# Altium schematic sheet Sheet1.SchDoc
size A; SheetNumber: 1; SheetTotal: 1
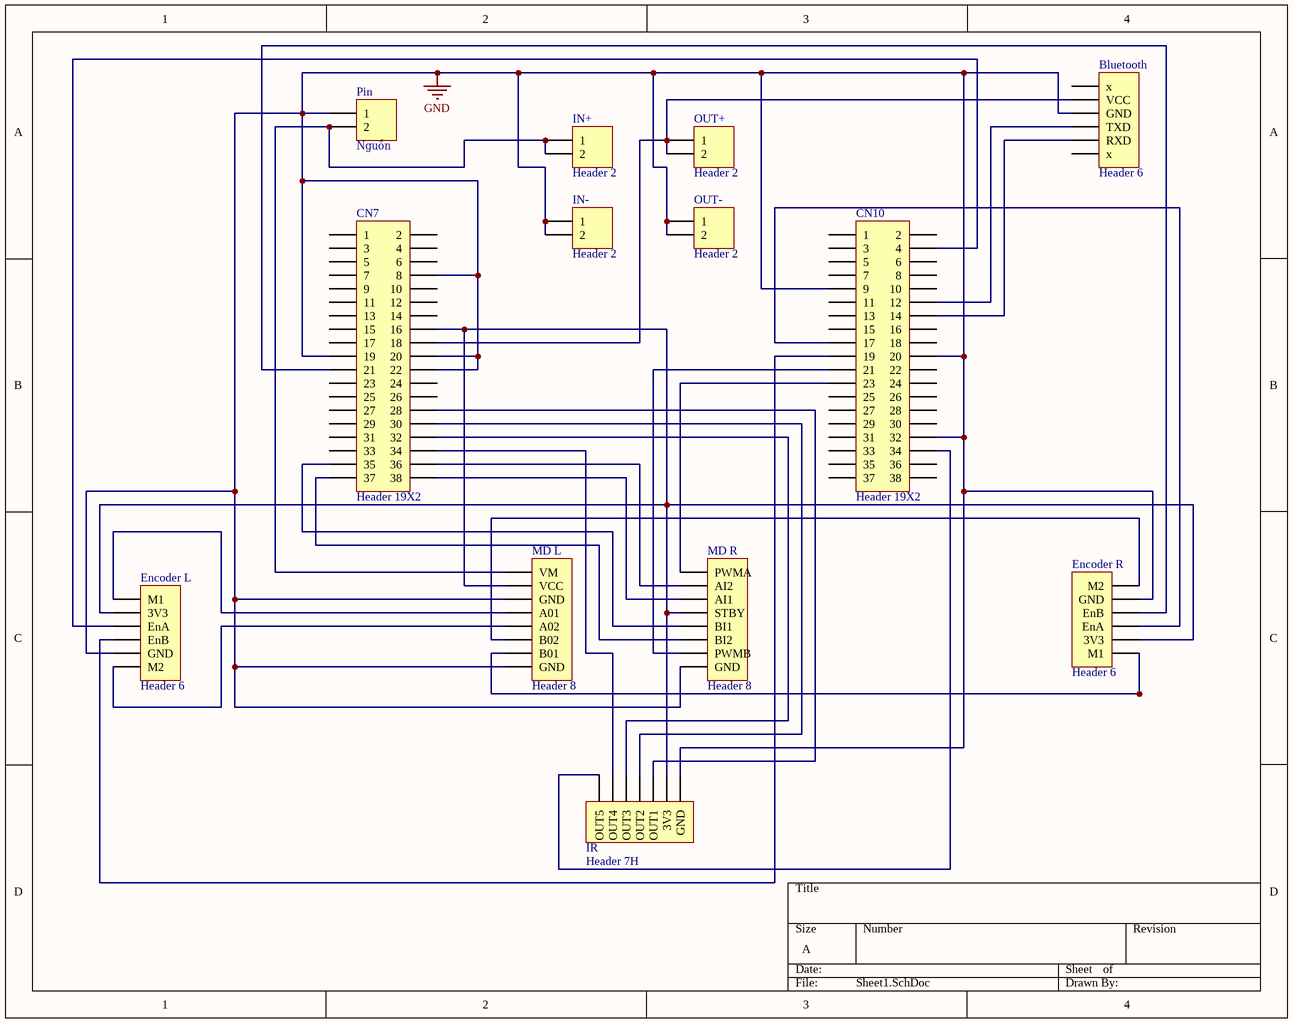
[diagram p0: Sheet1.SchDoc]

## Parts
Bluetooth  Header 6  [HDR1X6]
CN7  Header 19X2  [HDR2X19]
CN10  Header 19X2  [HDR2X19]
Encoder_L  Header 6  [HDR1X6]
Encoder_R  Header 6  [HDR1X6]
IN+  Header 2  [HDR1X2]
IN-  Header 2  [HDR1X2]
IR  Header 7H  [HDR1X7H]
MD_L  Header 8  [HDR1X8]
MD_R  Header 8  [HDR1X8]
OUT+  Header 2  [HDR1X2]
OUT-  Header 2  [HDR1X2]
Pin  Nguồn  [HDR1X2]

## Nets
GND: Bluetooth.3(GND) CN7.8 CN7.19 CN7.20 CN7.22 CN10.9 CN10.20 CN10.32 Encoder_L.5(GND) Encoder_R.5(GND) IN-.1 IN-.2 IR.1(GND) MD_L.3(GND) MD_L.8(GND) MD_R.8(GND) OUT-.1 OUT-.2 Pin.1
NetBluetooth_2: Bluetooth.2(VCC) CN7.18 OUT+.1 OUT+.2
NetBluetooth_4: Bluetooth.4(TXD) CN10.12
NetBluetooth_5: Bluetooth.5(RXD) CN10.14
NetCN7_16: CN7.16 Encoder_L.2(3V3) Encoder_R.2(3V3) IR.2(3V3) MD_L.2(VCC) MD_R.4(STBY)
NetCN7_21: CN7.21 Encoder_R.4(EnB)
NetCN7_28: CN7.28 IR.3(OUT1)
NetCN7_30: CN7.30 IR.4(OUT2)
NetCN7_32: CN7.32 IR.5(OUT3)
NetCN7_34: CN7.34 IR.6(OUT4)
NetCN7_35: CN7.35 MD_R.5(BI1)
NetCN7_36: CN7.36 MD_R.2(AI2)
NetCN7_37: CN7.37 MD_R.6(BI2)
NetCN7_38: CN7.38 MD_R.3(AI1)
NetCN10_4: CN10.4 Encoder_L.3(EnA)
NetCN10_17: CN10.17 Encoder_R.3(EnA)
NetCN10_19: CN10.19 Encoder_L.4(EnB)
NetCN10_21: CN10.21 MD_R.7(PWMB)
NetCN10_23: CN10.23 MD_R.1(PWMA)
NetCN10_34: CN10.34 IR.7(OUT5)
NetEncoder_L_1: Encoder_L.1(M1) MD_L.4(A01)
NetEncoder_L_6: Encoder_L.6(M2) MD_L.5(A02)
NetEncoder_R_1: Encoder_R.1(M1) MD_L.7(B01)
NetEncoder_R_6: Encoder_R.6(M2) MD_L.6(B02)
NetIN+_1: IN+.1 IN+.2 MD_L.1(VM) Pin.2

Not connected (* = marked no-connect by the designer): Bluetooth 1(x) 6(x); CN7 1 2 3 4 5 6 7 9 10 11 12 13 14 15 17 23 24 25 26 27 29 31 33; CN10 1 2 3 5 6 7 8 10 11 13 15 16 18 22 24 25 26 27 28 29 30 31 33 35 36 37 38

## Library data of the parts
Bluetooth Encoder_L Encoder_R = Header 6: Header, 6-Pin; LatestRevisionDate: 17-Jul-2002; LatestRevisionNote: Re-released for DXP Platform.; Publisher: Altium Limited
CN7 CN10 = Header 19X2: Header, 19-Pin, Dual row; LatestRevisionDate: 17-Jul-2002; LatestRevisionNote: Re-released for DXP Platform.; Publisher: Altium Limited
IN+ IN- OUT+ OUT- Pin = Header 2: Header, 2-Pin; LatestRevisionDate: 17-Jul-2002; LatestRevisionNote: Re-released for DXP Platform.; Publisher: Altium Limited
IR = Header 7H: Header, 7-Pin, Right Angle; LatestRevisionDate: 17-Jul-2002; LatestRevisionNote: Re-released for DXP Platform.; Publisher: Altium Limited
MD_L MD_R = Header 8: Header, 8-Pin; LatestRevisionDate: 17-Jul-2002; LatestRevisionNote: Re-released for DXP Platform.; Publisher: Altium Limited